# Altium schematic sheet Current-LoadSwitches.SchDoc
size A
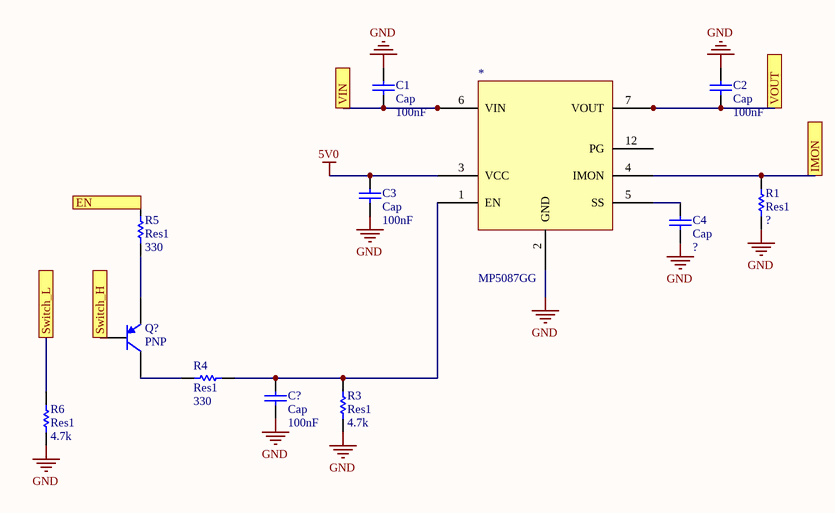
[diagram p0: Current-LoadSwitches.SchDoc]

## Parts
*  MP5087GG
C1  Cap  value 100nF  [0603]
C2  Cap  value 100nF  [0603]
C3  Cap  value 100nF  [0603]
C4  Cap  [0603]
C?  Cap  value 100nF  [0603]
Q?  PNP  [SOT-23B_N]
R1  Res1  [0603]
R3  Res1  value 4.7k  [0603]
R4  Res1  value 330  [0603]
R5  Res1  value 330  [AXIAL-0.3]
R6  Res1  value 4.7k  [0603]

## Ports
EN, IMON, Switch_H, Switch_L, VIN, VOUT

## Nets
5V0: *.3(VCC) C3.2
GND: *.2(GND) C1.2 C2.2 C3.1 C4.1 C?.1 R1.1 R3.1 R6.1
EN: R5.2 ; port EN
IMON: *.4(IMON) R1.2 ; port IMON
Switch_H: Q?.2(B) ; port Switch_H
Switch_L: R6.2 ; port Switch_L
VIN: *.6(VIN) *.11(VOUT) C1.1 ; port VIN
VOUT: *.7(VOUT) *.8(VOUT) *.9(VOUT) *.10(VOUT) C2.1 ; port VOUT
Net*_1: *.1(EN) C?.2 R3.2 R4.2
Net*_5: *.5(SS) C4.2
NetQ?_1: Q?.1(C) R4.1
NetQ?_3: Q?.3(E) R5.1

Not connected (* = marked no-connect by the designer): * 12(PG)

## Library data of the parts
* = Component_1
C1-C4 C? = Cap: Capacitor; Published: 8-Jun-2000; LatestRevisionDate: 17-Jul-2002; LatestRevisionNote: Re-released for DXP Platform.; PackageReference: RAD-0.3; Publisher: Altium Limited; PackageDescription: Radial Cap, Thru-Hole; 2 Leads; 0.3 in Pin Spacing
  C4: Value: ?
Q? = PNP: PNP Bipolar Transistor; Published: 8-Jun-2000; LatestRevisionDate: 29-May-2009; LatestRevisionNote: IPC-7351 Footprint Added.; PackageVersion: Aug-1999; PackageReference: SOT-23B; Publisher: Altium Limited; PackageDescription: 3-Pin SOT-23 Package 0.95 mm Pitch, 2.4 mm Lead Span
R1 R3-R6 = Res1: Resistor; Published: 8-Jun-2000; LatestRevisionDate: 17-Jul-2002; LatestRevisionNote: Re-released for DXP Platform.; PackageReference: AXIAL-0.3; Publisher: Altium Limited; PackageDescription: Axial Device, Thru-Hole; 2 Leads; 0.3 in Pin Spacing
  R1: Value: ?